# Altium project GanInverter.PrjPCB (part 1 of 3)
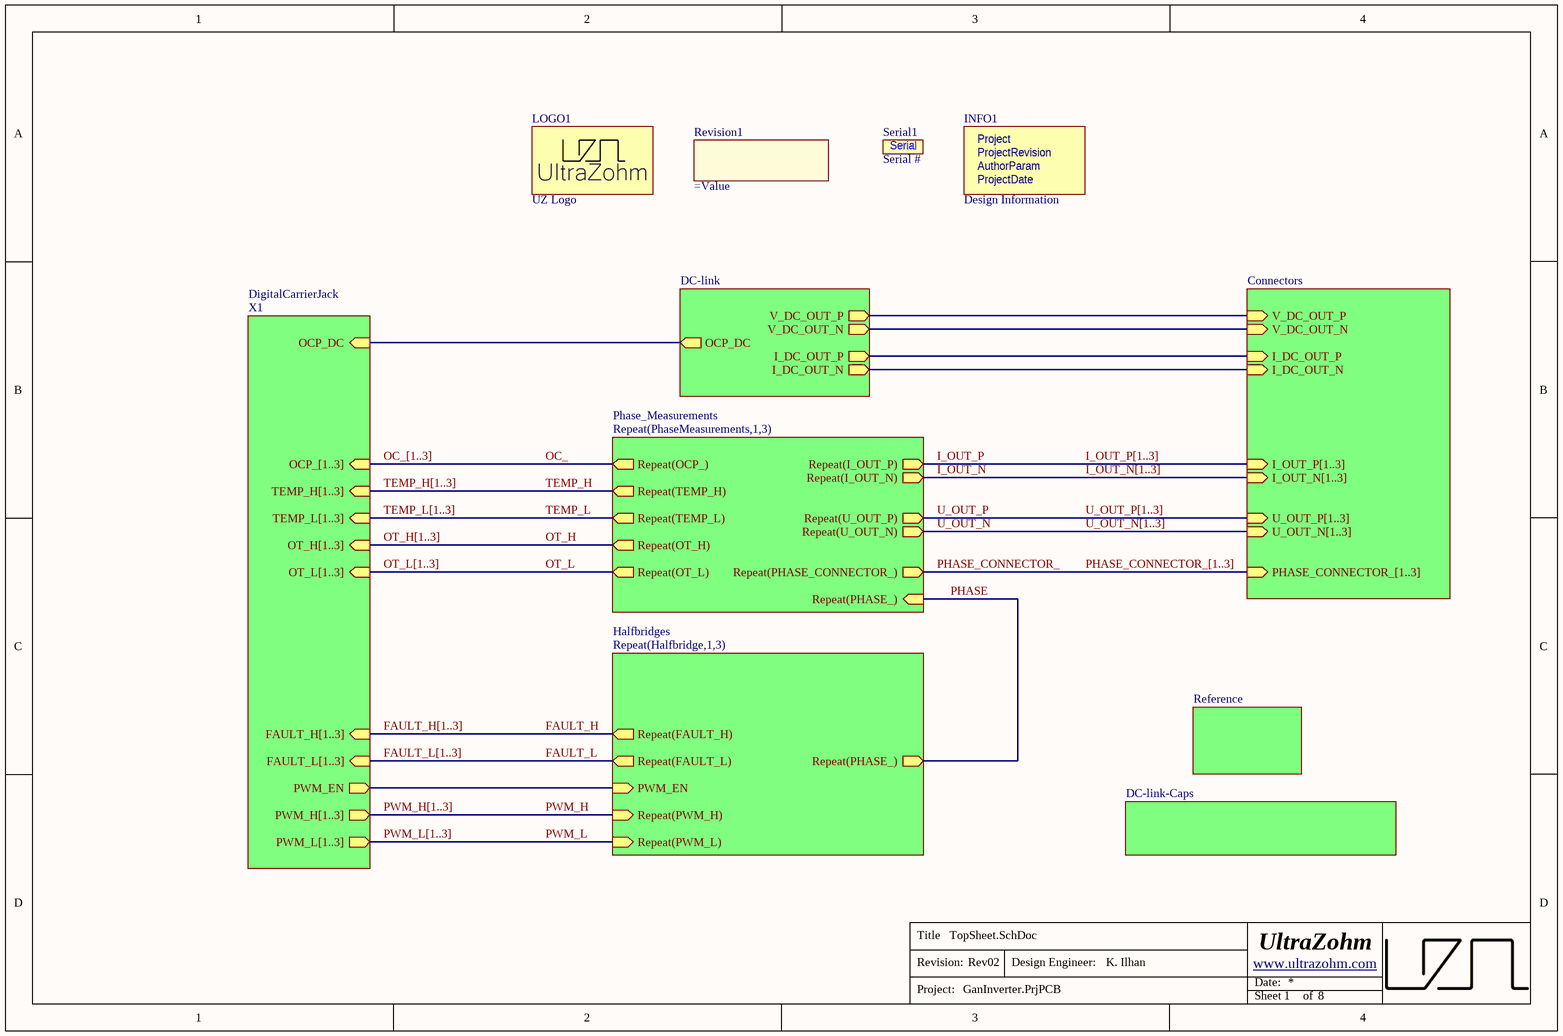
[diagram p0: TopSheet.SchDoc]
Author: K. Ilhan; AuthorParam: K. Ilhan; Project: UZ_D_GaN_Inverter; ProjectDate: 07/23; ProjectRevision: Rev02
8 sheets, 564 parts. Net scope: hierarchical (ports join the sheet entries above them; power ports are global).
Board file: GanInverter.PcbDoc
Sheets:
  TopSheet.SchDoc
    X1 = DigitalCarrierJack.SchDoc
     = Connectors.SchDoc
     = Reference.SchDoc
    PhaseMeasurements1 = Phase_Measurements.SchDoc
    PhaseMeasurements2 = Phase_Measurements.SchDoc
    PhaseMeasurements3 = Phase_Measurements.SchDoc
    Halfbridge1 = Halfbridges.SchDoc
    Halfbridge2 = Halfbridges.SchDoc
    Halfbridge3 = Halfbridges.SchDoc
     = DC-link.SchDoc
    DC-link-Caps = DC-link-Caps.SchDoc

## Sheet TopSheet.SchDoc
size A4; Author: K. Ilhan; CompanyName: Technische Hochschule Nürnberg Georg Simon Ohm; Organization: UltraZohm; Address1: Kesslerplatz 12; Address2: 90489 Nürnberg; Address3: GERMANY; SheetNumber: 1; SheetTotal: 8; Website: www.ultrazohm.com

### Parts
INFO1  Design Information  [Design_info]  (no BOM)
LOGO1  UZ Logo  [UZ_Logo_small]  (no BOM)
Revision1  (no value)  [Designator:comment]  (no BOM)
Serial1  Serial #  [SERIAL]  (no BOM)

### Sub-sheets
DC-link-Caps = DC-link-Caps.SchDoc: no entries
Repeat(Halfbridge,1,3) = Halfbridges: Repeat(PWM_H) (in), Repeat(PWM_L) (in), Repeat(PHASE_) (out), PWM_EN (in), Repeat(FAULT_L) (out), Repeat(FAULT_H) (out)
Repeat(PhaseMeasurements,1,3) = Phase_Measurements: Repeat(I_OUT_P) (out), Repeat(I_OUT_N) (out), Repeat(U_OUT_P) (out), Repeat(U_OUT_N) (out), Repeat(OT_H) (out), Repeat(OT_L) (out), Repeat(TEMP_H) (out), Repeat(TEMP_L) (out), Repeat(PHASE_CONNECTOR_) (out), Repeat(PHASE_) (in), Repeat(OCP_) (out)
X1 = DigitalCarrierJack: PWM_H[1..3] (out), PWM_L[1..3] (out), OT_H[1..3] (in), OT_L[1..3] (in), TEMP_H[1..3] (in), TEMP_L[1..3] (in), FAULT_L[1..3] (in), FAULT_H[1..3] (in), OCP_[1..3] (in), OCP_DC (in), PWM_EN (out)
? = Connectors: I_DC_OUT_N (in), I_DC_OUT_P (in), I_OUT_P[1..3] (in), I_OUT_N[1..3] (in), U_OUT_P[1..3] (in), U_OUT_N[1..3] (in), V_DC_OUT_N (in), V_DC_OUT_P (in), PHASE_CONNECTOR_[1..3] (in)
? = Reference: no entries
? = DC-link: I_DC_OUT_N (out), I_DC_OUT_P (out), V_DC_OUT_N (out), V_DC_OUT_P (out), OCP_DC (out)

### Nets
FAULT_H: sheet Repeat(Halfbridge,1,3)/Repeat(FAULT_H)
FAULT_L: sheet Repeat(Halfbridge,1,3)/Repeat(FAULT_L)
I_DC_OUT_N: sheet /I_DC_OUT_N, sheet /I_DC_OUT_N
I_DC_OUT_P: sheet /I_DC_OUT_P, sheet /I_DC_OUT_P
I_OUT_N: sheet Repeat(PhaseMeasurements,1,3)/Repeat(I_OUT_N)
I_OUT_P: sheet Repeat(PhaseMeasurements,1,3)/Repeat(I_OUT_P)
OC_: sheet Repeat(PhaseMeasurements,1,3)/Repeat(OCP_)
OCP_DC: sheet X1/OCP_DC, sheet /OCP_DC
OT_H: sheet Repeat(PhaseMeasurements,1,3)/Repeat(OT_H)
OT_L: sheet Repeat(PhaseMeasurements,1,3)/Repeat(OT_L)
PHASE: sheet Repeat(PhaseMeasurements,1,3)/Repeat(PHASE_), sheet Repeat(Halfbridge,1,3)/Repeat(PHASE_)
PHASE_CONNECTOR_: sheet Repeat(PhaseMeasurements,1,3)/Repeat(PHASE_CONNECTOR_)
PWM_EN: sheet X1/PWM_EN, sheet Repeat(Halfbridge,1,3)/PWM_EN
PWM_H: sheet Repeat(Halfbridge,1,3)/Repeat(PWM_H)
PWM_L: sheet Repeat(Halfbridge,1,3)/Repeat(PWM_L)
TEMP_H: sheet Repeat(PhaseMeasurements,1,3)/Repeat(TEMP_H)
TEMP_L: sheet Repeat(PhaseMeasurements,1,3)/Repeat(TEMP_L)
U_OUT_N: sheet Repeat(PhaseMeasurements,1,3)/Repeat(U_OUT_N)
U_OUT_P: sheet Repeat(PhaseMeasurements,1,3)/Repeat(U_OUT_P)
V_DC_OUT_N: sheet /V_DC_OUT_N, sheet /V_DC_OUT_N
V_DC_OUT_P: sheet /V_DC_OUT_P, sheet /V_DC_OUT_P

### Buses and harness runs
bus FAULT_H[1..3] = sheet X1/FAULT_H[1..3]
bus FAULT_L[1..3] = sheet X1/FAULT_L[1..3]
bus I_OUT_N[1..3] = sheet /I_OUT_N[1..3]
bus I_OUT_P[1..3] = sheet /I_OUT_P[1..3]
bus OC_[1..3] = sheet X1/OCP_[1..3]
bus OT_H[1..3] = sheet X1/OT_H[1..3]
bus OT_L[1..3] = sheet X1/OT_L[1..3]
bus PHASE_CONNECTOR_[1..3] = sheet /PHASE_CONNECTOR_[1..3]
bus PWM_H[1..3] = sheet X1/PWM_H[1..3]
bus PWM_L[1..3] = sheet X1/PWM_L[1..3]
bus TEMP_H[1..3] =  = sheet X1/TEMP_H[1..3]
bus TEMP_L[1..3] =  = sheet X1/TEMP_L[1..3]
bus U_OUT_N[1..3] = sheet /U_OUT_N[1..3]
bus U_OUT_P[1..3] = sheet /U_OUT_P[1..3]

### Notes on the sheet
- Title
- Revision:
- Design Engineer:
- Date:
- Project:
- Sheet
- of
- (in symbol Design Information) Project; ProjectRevision; AuthorParam; ProjectDate
- (in symbol SerialNumber) Serial

### Library data of the parts
INFO1 = Design Information: Manufacturer: UltraZohm; Created from: MGremer; Manufacturer Part Number: Design Information; PartID: 12; Created On: 11/3/2021 9:04:23 AM; ComponentLink1Description: https://docs.ultrazohm.com/; ComponentLink1URL: homepage; Component Type: Design Information; Last Updated: 11/3/2021 9:28:34 AM; Supplier 1: -; Supplier Part Number 1: -; Type: Design Information; Value: Design Information; Live Cycle Status: 1
LOGO1 = Logo small: Manufacturer: UltraZohm; Created from: MGremer; Created: Jan2021_Liegmann; Value: Logo; Manufacturer Part Number: Logo small; PartID: 10; Created On: 11/3/2021 9:04:23 AM; ComponentLink1Description: https://docs.ultrazohm.com/; ComponentLink1URL: homepage; Component Type: Logo; Last Updated: 11/3/2021 9:05:50 AM; Supplier 1: -; Supplier Part Number 1: -; Type: Logo; Live Cycle Status: 1
Revision1 = ProjectRevision: Value: Rev02; Created: 2020-01-08_Thilo_Wendt
Serial1 = SerialNumber: Empty serial number of the PCB. Can be used for manually writing the serial number

## Sheet DigitalCarrierJack.SchDoc
size A4; Author: K. Ilhan; CompanyName: Technische Hochschule Nürnberg Georg Simon Ohm; Organization: UltraZohm; Address1: Kesslerplatz 12; Address2: 90489 Nürnberg; Address3: GERMANY; SheetNumber: 2; SheetTotal: 8; Website: www.ultrazohm.com
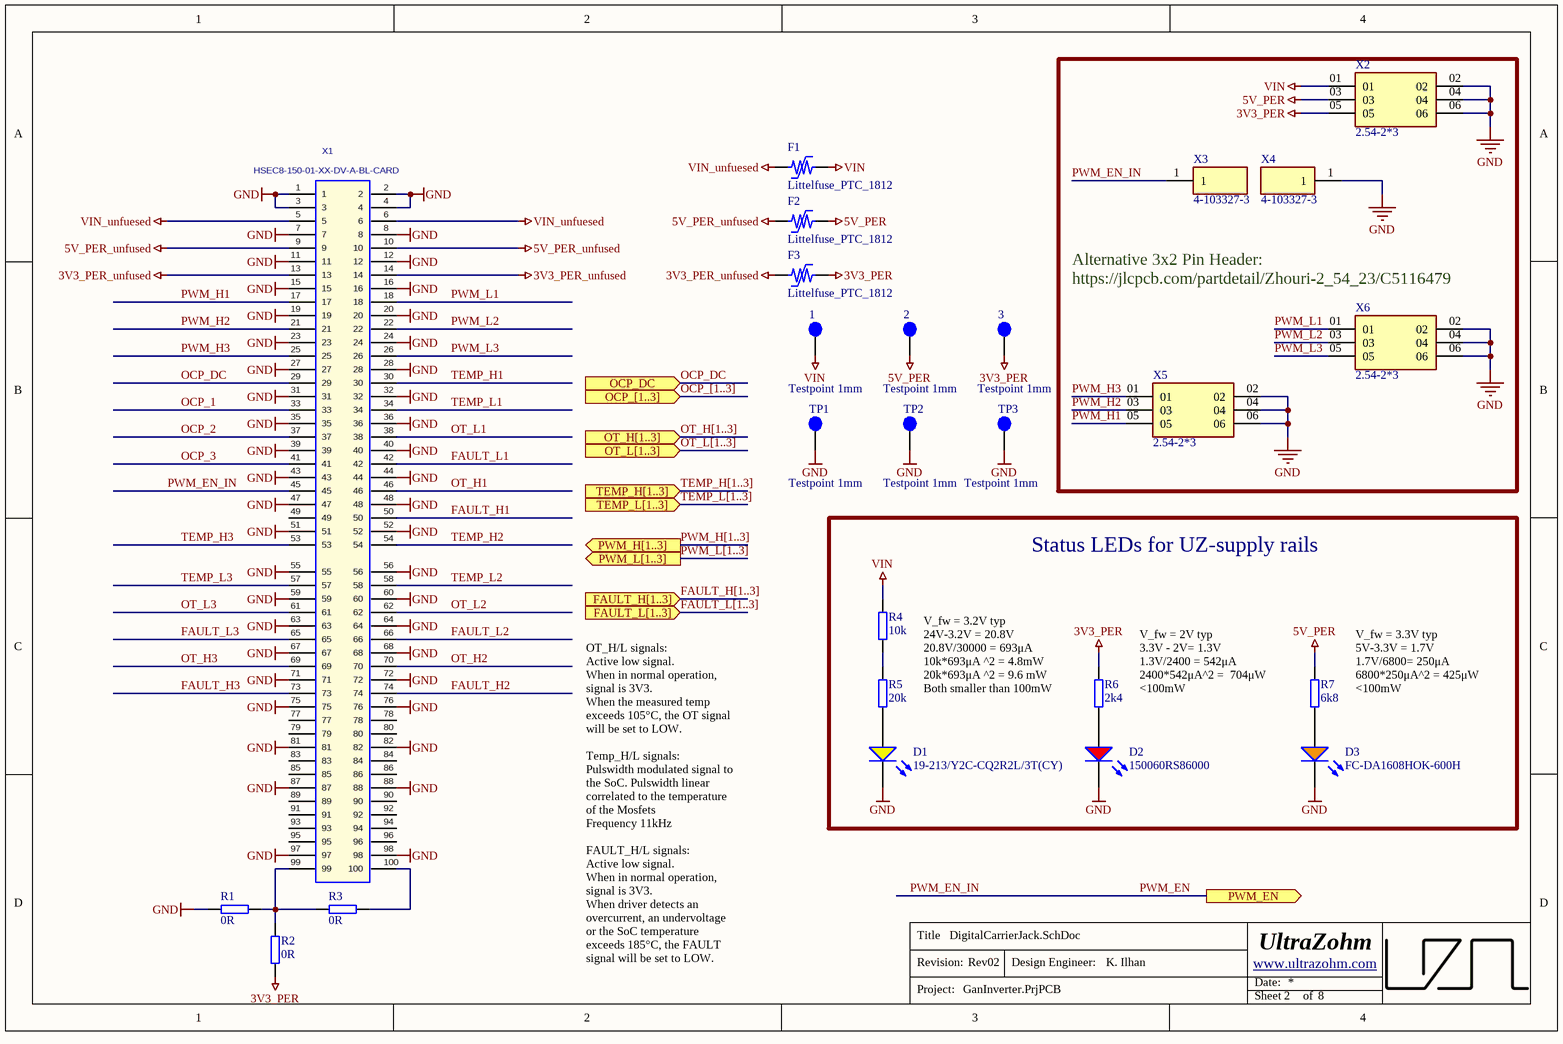
[diagram p1: DigitalCarrierJack.SchDoc]

### Parts
1  Testpoint 1mm  [TP_1mm]  (no BOM)
2  Testpoint 1mm  [TP_1mm]  (no BOM)
3  Testpoint 1mm  [TP_1mm]  (no BOM)
D1  19-213/Y2C-CQ2R2L/3T(CY)  [WL-SMCW_0603]
D2  150060RS86000  [WL-SMCW_0603]
D3  FC-DA1608HOK-600H  [WL-SMCW_0603]
F1  Littelfuse_PTC_1812  [1812_PTC_Polyfuse_Littelfuse]
F2  Littelfuse_PTC_1812  [1812_PTC_Polyfuse_Littelfuse]
F3  Littelfuse_PTC_1812  [1812_PTC_Polyfuse_Littelfuse]
R1  0R  [RES 0603_1608]
R2  0R  [RES 0603_1608]
R3  0R  [RES 0603_1608]
R4  10k  [RES 0603_1608]
R5  20k  [RES 0603_1608]
R6  2k4  [RES 0603_1608]
R7  6k8  [RES 0603_1608]
TP1  Testpoint 1mm  [TP_1mm]  (no BOM)
TP2  Testpoint 1mm  [TP_1mm]  (no BOM)
TP3  Testpoint 1mm  [TP_1mm]  (no BOM)
X1  HSEC8-150-01-XX-DV-A-BL-CARD  [HSEC8-150-01-XX-DV-A-BL-CARD]  (no BOM)
X2  2.54-2*3  [SAMTEC_TSW-103-05-G-D]
X3  4-103327-3  [1_Pin_Header]
X4  4-103327-3  [1_Pin_Header]
X5  2.54-2*3  [SAMTEC_TSW-103-05-G-D]
X6  2.54-2*3  [SAMTEC_TSW-103-05-G-D]

### Blocks framed on the sheet
Status LEDs for UZ-supply rails: D1-D3 R4-R7

### Ports
FAULT_H[1..3] (in), FAULT_L[1..3] (in), OCP_[1..3] (in), OCP_DC (in), OT_H[1..3] (in), OT_L[1..3] (in), PWM_EN (out), PWM_H[1..3] (out), PWM_L[1..3] (out), TEMP_H[1..3] (in), TEMP_L[1..3] (in)

### Nets
3V3_PER: 3.1 F3.2 R2.1 R6.2 X2.05
3V3_PER_unfused: F3.1 X1.13 X1.14
5V_PER: 2.1 F2.2 R7.2 X2.03
5V_PER_unfused: F2.1 X1.9 X1.10
GND: D1.1(K) D2.1(K) D3.1(K) R1.1 TP1.1 TP2.1 TP3.1 X1.1 X1.2 X1.3 X1.4 X1.7 X1.8 X1.11 X1.12 X1.15 X1.16 X1.19 X1.20 X1.23 X1.24 X1.27 X1.28 X1.31 X1.32 X1.35 X1.36 X1.39 X1.40 X1.43 X1.44 X1.47 X1.48 X1.51 X1.52 X1.55 X1.56 X1.59 X1.60 X1.63 X1.64 X1.67 X1.68 X1.71 X1.72 X1.75 X1.76 X1.81 X1.82 X1.87 X1.88 X1.97 X1.98 X2.02 X2.04 X2.06 X4.1 X5.02 X5.04 X5.06 X6.02 X6.04 X6.06
VIN: 1.1 F1.2 R4.2 X2.01
VIN_unfuesed: F1.1 X1.5 X1.6
FAULT_H1: X1.50  [project net FAULT_H]
FAULT_H2: X1.74  [project net FAULT_H]
FAULT_H3: X1.73  [project net FAULT_H]
FAULT_L1: X1.42  [project net FAULT_L]
FAULT_L2: X1.66  [project net FAULT_L]
FAULT_L3: X1.65  [project net FAULT_L]
OCP_1: X1.33  [project net OC_1]
OCP_2: X1.37  [project net OC_2]
OCP_3: X1.41  [project net OC_3]
OCP_DC: X1.29 ; port OCP_DC
OT_H1: X1.46
OT_H2: X1.70
OT_H3: X1.69
OT_L1: X1.38
OT_L2: X1.62
OT_L3: X1.61
PWM_EN: X1.45 X3.1 ; port PWM_EN  [also labelled PWM_EN_IN]
PWM_H1: X1.17 X5.05  [project net PWM_H]
PWM_H2: X1.21 X5.03  [project net PWM_H]
PWM_H3: X1.25 X5.01  [project net PWM_H]
PWM_L1: X1.18 X6.01  [project net PWM_L]
PWM_L2: X1.22 X6.03  [project net PWM_L]
PWM_L3: X1.26 X6.05  [project net PWM_L]
TEMP_H1: X1.30
TEMP_H2: X1.54
TEMP_H3: X1.53
TEMP_L1: X1.34
TEMP_L2: X1.58
TEMP_L3: X1.57
NetD1_2: D1.2(A) R5.1
NetD2_2: D2.2(A) R6.1
NetD3_2: D3.2(A) R7.1
NetR1_2: R1.2 R2.2 R3.1 X1.99
NetR3_2: R3.2 X1.100
NetR4_1: R4.1 R5.2

Not connected (* = marked no-connect by the designer): X1 49 77 78 79 80 83 84 85 86 89 90 91 92 93 94 95 96

### Buses and harness runs
bus FAULT_H[1..3] = port FAULT_H[1..3]
bus FAULT_L[1..3] = port FAULT_L[1..3]
bus OCP_[1..3] = port OCP_[1..3]
bus OT_H[1..3] = port OT_H[1..3]
bus OT_L[1..3] = port OT_L[1..3]
bus PWM_H[1..3] = port PWM_H[1..3]
bus PWM_L[1..3] = port PWM_L[1..3]
bus TEMP_H[1..3] = port TEMP_H[1..3]
bus TEMP_L[1..3] = port TEMP_L[1..3]

### Notes on the sheet
- (near X6) Alternative 3x2 Pin Header:
  https://jlcpcb.com/partdetail/Zhouri-2_54_23/C5116479
- V_fw = 3.2V typ
  24V-3.2V = 20.8V
  20.8V/30000 = 693μA
  10k*693μA ^2 = 4.8mW
  20k*693μA ^2 = 9.6 mW
  Both smaller than 100mW
- V_fw = 2V typ
  3.3V - 2V= 1.3V
  1.3V/2400 = 542μA
  2400*542μA^2 =  704μW
  <100mW
- V_fw = 3.3V typ
  5V-3.3V = 1.7V
  1.7V/6800= 250μA
  6800*250μA^2 = 425μW
  <100mW
- OT_H/L signals:
  Active low signal.
  When in normal operation, signal is 3V3.
  When the measured temp exceeds 105°C, the OT signal will be set to LOW.
- Temp_H/L signals:
  Pulswidth modulated signal to the SoC. Pulswidth linear correlated to the temperature of the Mosfets
  Frequency 11kHz
- FAULT_H/L signals:
  Active low signal.
  When in normal operation, signal is 3V3.
  When driver detects an overcurrent, an undervoltage or the SoC temperature exceeds 185°C, the FAULT signal will be set to LOW.
- Title
- Revision:
- Design Engineer:
- Date:
- Project:
- Sheet
- of

### Library data of the parts
1-3 TP1-TP3 = NULL: Manufacturer Part Number: NULL; Created from: AGeiger; Created: 2018_06_25_AGeiger; Value: Testpoint 1mm; PartID: 9; Created On: 9/20/2022 1:14:57 PM; Component Type: Testpoint; Last Updated: 9/20/2022 1:15:39 PM; Manufacturer: NULL; Supplier 1: NULL; Supplier Part Number 1: NULL; Type: Testpoint; Live Cycle Status: 1
D1 = 19-213/Y2C-CQ2R2L/3T(CY): LED YELLOW 585.5~591.5NM 90~180MCD@20MA TOP VIEW 0603 ROHS; Manufacturer: Everlight Elec; Type: Standard; Created from: T. Wendt; Forward Current I_f: 20 mA; Forward Voltage U_f: 2 V; Wavelength: 590 nm; Light Intensity: 180 mcd; Nominal Power: 40 mW; Manufacturer Part Number: 19-213/Y2C-CQ2R2L/3T(CY); PartID: 9; Created On: 3/3/2021 10:06:23 AM; ComponentLink1Description: Datasheet; ComponentLink1URL: https://datasheet.lcsc.com/szlcsc/Everlight-Elec-19-213-Y2C-CQ2R2L-3T-CY_C72038.pdf; Component Type: LED Diode; Device Package: 0603; Last Updated: 3/4/2021 9:02:49 AM; Mounting Type: SMD; Operating Temperature: -40 - 85 °C; Supplier 1: LCSC; Supplier Part Number 1: C72038; Live Cycle Status: 1; Stock number: not stored; Color: yellow; LCSC Part Number: C72038
D2 = 150060RS86000: WL-SMCW SMD Mono-color Chip LED Waterclear Red; Manufacturer: Wuerth Elektronik; Type: Standard; Created from: MGremer; Forward Current I_f: 20 mA; Forward Voltage U_f: 2 V; Wavelength: 624 nm; Light Intensity: 800 mcd; Nominal Power: 48 mW; Manufacturer Part Number: 150060RS86000; PartID: 3; Created On: 12/8/2020 10:48:12 AM; ComponentLink1Description: Datasheet; ComponentLink1URL: https://www.mouser.de/datasheet/2/445/150120RS75000-1714636.pdf; Component Type: LED Diode; Device Package: 0603; Last Updated: 2/15/2023 6:12:03 PM; Mounting Type: SMD; Operating Temperature: -40 - 85 °C; Supplier 1: Mouser; Supplier Part Number 1: 710-150060RS86000; Supplier 2: Farnell; Supplier Part Number 2: 3408608; Supplier 3: Digi-Key; Supplier Part Number 3: 732-150060RS86000CT-ND; Live Cycle Status: 1; Stock number: not stored; Color: red; LCSC Part Number: C389517
D3 = FC-DA1608HOK-600H: LED ORANGE 600~610NM 80~220MCD@20MA TOP VIEW 0603 ROHS; Manufacturer: Foshan NationStar Optoelectronics; Type: Standard; Created from: T. Wendt; Color: amber; Forward Current I_f: 20 mA; Forward Voltage U_f: 2 V; Wavelength: 604 nm; Light Intensity: 150 mcd; Nominal Power: 40 mW; Manufacturer Part Number: FC-DA1608HOK-600H; PartID: 10; Created On: 3/3/2021 9:59:51 AM; ComponentLink1Description: Datasheet; ComponentLink1URL: https://datasheet.lcsc.com/szlcsc/Foshan-NationStar-Optoelectronics-FC-DA1608HOK-600H_C84269.pdf; Component Type: LED Diode; Device Package: 0603; Last Updated: 3/4/2021 9:02:50 AM; Mounting Type: SMD; Operating Temperature: -40 - 85 °C; Supplier 1: LCSC; Supplier Part Number 1: C84269; Live Cycle Status: 1; Stock number: not stored; LCSC Part Number: C84269
F1-F3 = Littelfuse_PTC_1812: POLYSWITCH RESETTABLE DEVICES; MPN: miniASMDC110F/24; Value: PTC, 1.1 A, 24V; Voltage: 24V; Trip Current: 2.2A; Hold Current: 1.1A; Resistance: 0.18 Ohm; Type: Fuse; Nominal current: 1 A; Created from: MHlatky; MF: Littelfuse; Created: 2019_02_10_AGeiger; Package: 1812; ComponentLink1URL: https://www.littelfuse.com/~/media/electronics/datasheets/resettable_ptcs/littelfuse_ptc_surface_mount_catalog_datasheet.pdf.pdf; ComponentLink1Description: Datasheet; Manufacturer Part Number: Littelfuse_PTC_1812; PartID: 5; Created On: 5/7/2021 6:50:33 AM; Component Type: Littelfuse_PTC_1812; Last Updated: 5/27/2022 3:06:17 PM; Manufacturer: Littelfuse; Mounting Type: SMD; Operating Temperature: -40 - 85 °C; Supplier 1: Mouser; Supplier Part Number 1: 530-0ZCG0150BF2C; Live Cycle Status: 1; LCSC Part Number: C70119
R1-R3 = RC0603JR-070RL: SMD resistor E24 series; Manufacturer: YAGEO; Tolerance: 5%; Created from: MGremer; Manufacturer Part Number: RC0603JR-070RL; PartID: 1; Created On: 12/14/2020 4:17:14 PM; ComponentLink1Description: Datasheet; ComponentLink1URL: https://www.mouser.de/datasheet/2/447/PYu-RC_Group_51_RoHS_L_10-1664068.pdf; Component Type: SMD resistor; Device Package: 0603; Last Updated: 3/4/2021 9:09:42 AM; Mounting Type: SMD; Supplier 1: Mouser; Supplier Part Number 1: 603-RC0603JR-070RL; Supplier 2: LCSC; Supplier Part Number 2: C21189; Type: Resistor; Value: 0R; Live Cycle Status: 1; Stock number: Labor SMD Container; LCSC Part Number: C21189
R4 = RK73B1JTTD103J: SMD resistor E24 series; Manufacturer: KOA Speer; Tolerance: 5%; Created from: MGremer; Manufacturer Part Number: RK73B1JTTD103J; PartID: 98; Created On: 12/14/2020 4:17:14 PM; ComponentLink1Description: Datasheet; ComponentLink1URL: https://www.mouser.de/datasheet/2/219/RK73B-1825463.pdf; Component Type: SMD resistor; Device Package: 0603; Last Updated: 5/27/2022 2:04:22 PM; Mounting Type: SMD; Supplier 1: Mouser; Supplier Part Number 1: 660-RK73B1JTTD103J; Type: Resistor; Value: 10k; Live Cycle Status: 1; Stock number: Labor SMD Container; LCSC Part Number: C25804
R5 = 0603WAF2002T5E: SMD resistor E24 series; Manufacturer: UNI-ROYAL; Tolerance: 1%; Created from: AGeiger; Manufacturer Part Number: 0603WAF2002T5E; PartID: 105; Created On: 12/14/2020 4:17:14 PM; ComponentLink1Description: Datasheet; ComponentLink1URL: https://datasheet.lcsc.com/lcsc/2206010230_UNI-ROYAL-Uniroyal-Elec-0603WAF2002T5E_C4184.pdf; Component Type: SMD resistor; Device Package: 0603; Last Updated: 8/25/2022 8:05:50 PM; Mounting Type: SMD; Supplier 1: LCSC; Supplier Part Number 1: C4184; Type: Resistor; Value: 20k; Live Cycle Status: 1; Stock number: Labor SMD Container; LCSC Part Number: C4184
R6 = CR0603F2K40P05Z: 100mW ±100ppm/℃ ±1% 2.4kΩ 0603 Chip Resistor - Surface Mount ROHS; Manufacturer: Ever Ohms Tech; Created from: KIlhan; Manufacturer Part Number: CR0603F2K40P05Z; PartID: 278; Created On: 7/5/2023 5:27:52 PM; ComponentLink1Description: Datasheet; ComponentLink1URL: https://jlcpcb.com/partdetail/Ever_OhmsTech-CR0603F2K40P05Z/C881363; Component Type: SMD resistor; Device Package: 0603; Last Updated: 7/5/2023 5:27:52 PM; Mounting Type: SMD; Supplier 1: LCSC; Supplier Part Number 1: C881363; Type: Resistor; Tolerance: 1%; Value: 2k4; Live Cycle Status: 1; Stock number: not stored; LCSC Part Number: C881363
R7 = RS-03K682JT: 100mW ±100ppm/℃ ±5% 6.8kΩ 0603  Chip Resistor - Surface Mount ROHS; Manufacturer: FH (Guangdong Fenghua Advanced Tech); Created from: KIlhan; Manufacturer Part Number: RS-03K682JT; PartID: 279; Created On: 7/5/2023 6:08:31 PM; ComponentLink1Description: Datasheet; ComponentLink1URL: https://jlcpcb.com/parts/2nd/Resistors/Chip_Resistor_Surface_Mount_4?searchTxt=6.8k; Component Type: SMD resistor; Device Package: 0603; Last Updated: 7/5/2023 6:19:43 PM; Supplier 1: LCSC; Supplier Part Number 1: C118365; Type: Resistor; Tolerance: 5%; Value: 6k8; Live Cycle Status: 1; Stock number: not stored; LCSC Part Number: C118365; Mounting Type: SMD
X1 = HSEC8-150-01-XX-DV-A-BL-CARD: Mating Card Layout for HSEC8-150-01-XX-DV-A-BL; Manufacturer: SAMTEC; Created: 2018_04_23_AGeiger; Value: HSEC8-150-01-XX-DV-A-BL-CARD
X2 X5 X6 = 2.54-2*3: Pin Header 3x2; Manufacturer: ZHOURI; MF: Samtec; Created from: KIlhan; Number of positions: 3; Availability: Unavailable; Value: *; Price: None; MP: TSW-103-05-G-D; Package: None; Manufacturer Part Number: 2.54-2*3; PartID: 14; Created On: 7/5/2023 4:24:09 PM; ComponentLink1Description: Datasheet; ComponentLink1URL: https://datasheet.lcsc.com/lcsc/2207291800_ZHOURI-2-54-1-3_C5116482.pdf; Component Type: Pin Header; Device Package: THT; Last Updated: 7/5/2023 4:24:09 PM; Mounting Type: THT; Operating Temperature: -55 -125 °C; Series: 2.54-1*3; Supplier 1: LCSC; Supplier Part Number 1: ZHOURI 2.54-1*3; Type: Pin Header; Live Cycle Status: 1; Stock number: not stored; Number of rows: 2; LCSC Part Number: C5116479
X3 X4 = 4-103327-3: Pin Header, 2.54mm, 1 Pin; Manufacturer: TE Connectivity; Created from: DHufnagel; Number of positions: 1; Manufacturer Part Number: 4-103327-3; PartID: 12; Created On: 8/18/2022 9:37:37 AM; ComponentLink1Description: Datasheet; ComponentLink1URL: https://www.mouser.de/datasheet/2/418/NG_CD_103327_T_baseFilename-749242.pdf; Component Type: Pin Header; Device Package: THT; Last Updated: 6/16/2023 12:29:10 PM; Mounting Type: THT; Operating Temperature: -65 - 105 °C; Series: AMPMODU MOD II; Supplier 1: Mouser; Supplier Part Number 1: 571-4-103327-3; Type: Pin Header; Live Cycle Status: 1; LCSC Part Number: C3347196; Stock number: not stored; Number of rows: 1

## Sheet Connectors.SchDoc
size A4; Author: K. Ilhan; CompanyName: Technische Hochschule Nürnberg Georg Simon Ohm; Organization: UltraZohm; Address1: Kesslerplatz 12; Address2: 90489 Nürnberg; Address3: GERMANY; SheetNumber: 3; SheetTotal: 8; Website: www.ultrazohm.com
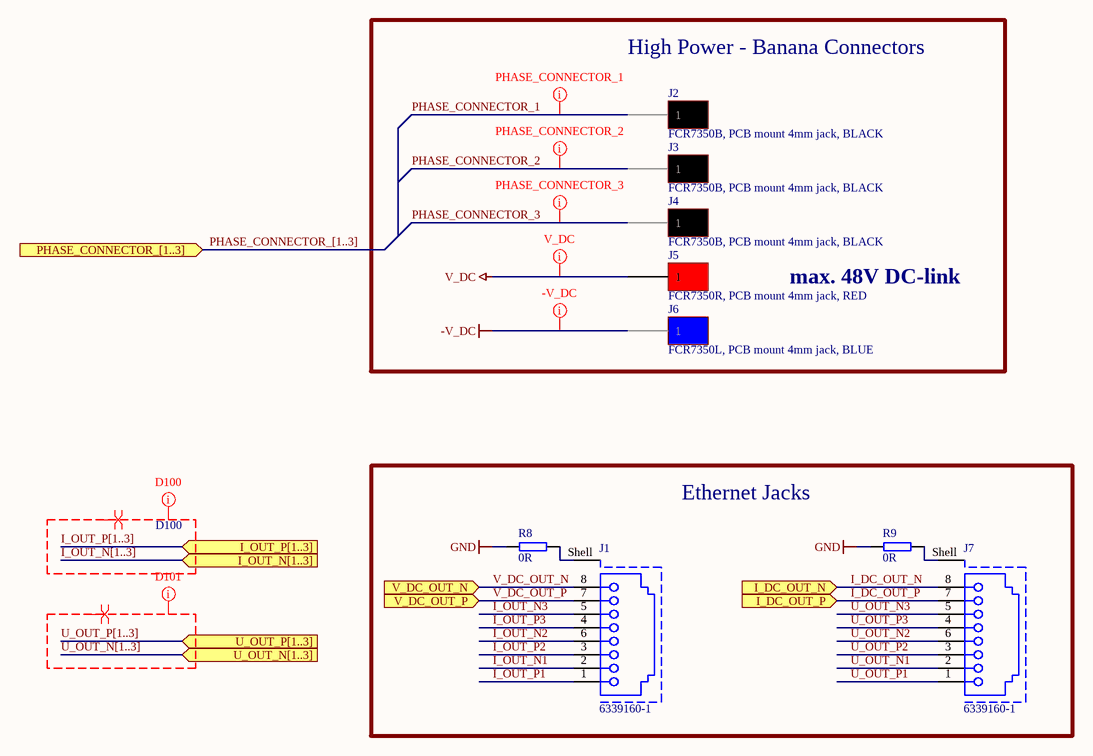
[diagram p2: Connectors.SchDoc]

### Parts
J1  6339160-1  [634008149821]
J2  FCR7350B, PCB mount 4mm jack, BLACK  [FCR7350]
J3  FCR7350B, PCB mount 4mm jack, BLACK  [FCR7350]
J4  FCR7350B, PCB mount 4mm jack, BLACK  [FCR7350]
J5  FCR7350R, PCB mount 4mm jack, RED  [FCR7350]
J6  FCR7350L, PCB mount 4mm jack, BLUE  [FCR7350]
J7  6339160-1  [634008149821]
R8  0R  [RES 0603_1608]
R9  0R  [RES 0603_1608]

### Blocks framed on the sheet
Ethernet Jacks: J1 J7 R8 R9

### Ports
I_DC_OUT_N (in), I_DC_OUT_P (in), I_OUT_N[1..3] (in), I_OUT_P[1..3] (in), PHASE_CONNECTOR_[1..3] (in), U_OUT_N[1..3] (in), U_OUT_P[1..3] (in), V_DC_OUT_N (in), V_DC_OUT_P (in)

### Nets
-V_DC: J6.1
GND: R8.1 R9.1
V_DC: J5.1
I_DC_OUT_N: J7.8 ; port I_DC_OUT_N
I_DC_OUT_P: J7.7 ; port I_DC_OUT_P
I_OUT_N1: J1.2  [project net I_OUT_N]
I_OUT_N2: J1.6  [project net I_OUT_N]
I_OUT_N3: J1.5  [project net I_OUT_N]
I_OUT_P1: J1.1  [project net I_OUT_P]
I_OUT_P2: J1.3  [project net I_OUT_P]
I_OUT_P3: J1.4  [project net I_OUT_P]
PHASE_CONNECTOR_1: J2.1  [project net PHASE_CONNECTOR_]
PHASE_CONNECTOR_2: J3.1  [project net PHASE_CONNECTOR_]
PHASE_CONNECTOR_3: J4.1  [project net PHASE_CONNECTOR_]
U_OUT_N1: J7.2  [project net U_OUT_N]
U_OUT_N2: J7.6  [project net U_OUT_N]
U_OUT_N3: J7.5  [project net U_OUT_N]
U_OUT_P1: J7.1  [project net U_OUT_P]
U_OUT_P2: J7.3  [project net U_OUT_P]
U_OUT_P3: J7.4  [project net U_OUT_P]
V_DC_OUT_N: J1.8 ; port V_DC_OUT_N
V_DC_OUT_P: J1.7 ; port V_DC_OUT_P
NetJ1_Shell: J1.Shell R8.2
NetJ7_Shell: J7.Shell R9.2

### Buses and harness runs
bus I_OUT_N[1..3] = port I_OUT_N[1..3]
bus I_OUT_P[1..3] = port I_OUT_P[1..3]
bus PHASE_CONNECTOR_[1..3] = port PHASE_CONNECTOR_[1..3]
bus U_OUT_N[1..3] = port U_OUT_N[1..3]
bus U_OUT_P[1..3] = port U_OUT_P[1..3]

### Layout directives
differential pair: I_OUT_N[1..3], I_OUT_P[1..3], U_OUT_N[1..3], U_OUT_P[1..3]
net class D100: I_OUT_N[1..3], I_OUT_P[1..3]
mark named D101: U_OUT_N[1..3], U_OUT_P[1..3]
net class Power: -V_DC, PHASE_CONNECTOR_, V_DC

### Notes on the sheet
- High Power - Banana Connectors
- max. 48V DC-link
- Title
- Revision:
- Design Engineer:
- Date:
- Project:
- Sheet
- of

### Library data of the parts
J1 J7 = 6339160-1: RJ45 RJReceptacle 1 Yes cat5 Without LED SMD Ethernet Connectors/Modular Connectors (RJ45 RJ11) ROHS; Manufacturer: TE; Match Code: WR-MJ; Contact Resistance: 20mOhm; Insulation Resistance: 500MOhm; LED: No; Number of Ports: 1; Rated Current: 1.5A; Working Voltage: 120VAC; Withstanding Voltage: 1000VAC; Created from: NDiringer; ComponentLink1Description: Datasheet; ComponentLink1URL: https://jlcpcb.com/partdetail/TeConnectivity-63391601/C125076; ComponentLink2Description: Datasheet; ComponentLink2URL: https://www.we-online.com/redexpert/spec/634008149821?ad; Category: Input/Output Connectors; Manufacturer Part Number: 6339160-1; Mount: Surface Mount; Operating Temperature Max: 85°C; Operating Temperature Min: -40°C; Packaging: Tray; Number of Pins: 8P8C; Orientation: Horizontal; Shielding: Yes; PartID: 8; Created On: 4/20/2023 12:29:11 PM; Component Type: RJ45 Connector; Device Package: RJ45; Last Updated: 4/20/2023 12:29:11 PM; Mounting Type: SMD; Series: RJHSE; Supplier 1: LCSC; Supplier Part Number 1: C125076; Type: RJ45 Connector; Live Cycle Status: 1; Stock number: not stored; LCSC Part Number: C125076
J2-J4 = FCR7350B: FCR7350B, 1000V, 24A, BLACK; Manufacturer: Cliff; Value: PCB mount 4mm jack, Black	FCR7350B, 1000V, 24A; Created from: DHufnagel; Manufacturer Part Number: FCR7350B; PartID: 6; Created On: 6/13/2022 10:18:11 AM; ComponentLink1Description: datasheet; ComponentLink1URL: https://www.cliffuk.co.uk/products/testleads/sockets/S16NPC.pdf; ComponentLink2Description: drawing; ComponentLink2URL: https://media.digikey.com/pdf/Data%20Sheets/Cliff%20Electronic%20LTD%20PDF's/FCR7350_Drawing.pdf; Component Type: PCB mount 4mm jack, Black; Device Package: THT; Last Updated: 6/28/2022 1:58:37 PM; Minimum Order: 1; Mounting Type: THT; Operating Temperature: -40°C - 80°C; Series: S16N-PC; Supplier 1: Digi-Key; Supplier Part Number 1: 3185-FCR7350B-ND; Supplier 2: farnell; Supplier Part Number 2: 1854507; Type: PCB mount 4mm jack, Black	FCR7350B, 1000V, 24A; Live Cycle Status: 1; Stock number: not stored
J5 = FCR7350R: FCR7350B, 1000V, 24A, RED; Manufacturer: Cliff; Value: PCB mount 4mm jack, Red FCR7350R, 1000V, 24A; Created from: DHufnagel; Manufacturer Part Number: FCR7350R; PartID: 7; Created On: 6/13/2022 10:18:11 AM; ComponentLink1Description: datasheet; ComponentLink1URL: https://www.cliffuk.co.uk/products/testleads/sockets/S16NPC.pdf; ComponentLink2Description: drawing; ComponentLink2URL: https://media.digikey.com/pdf/Data%20Sheets/Cliff%20Electronic%20LTD%20PDF's/FCR7350_Drawing.pdf; Component Type: PCB mount 4mm jack, Red; Device Package: THT; Last Updated: 6/28/2022 1:58:37 PM; Minimum Order: 1; Mounting Type: THT; Operating Temperature: -40°C - 80°C; Series: S16N-PC; Supplier 1: Digi-Key; Supplier Part Number 1: 3185-FCR7350R-ND; Supplier 2: farnell; Supplier Part Number 2: 1854508; Type: PCB mount 4mm jack, Red FCR7350R, 1000V, 24A; Live Cycle Status: 1; Stock number: not stored
J6 = FCR7350L: FCR7350B, 1000V, 24A, BLUE; Manufacturer: Cliff; Value: PCB mount 4mm jack, Blue FCR7350L, 1000V, 24A; Created from: DHufnagel; Manufacturer Part Number: FCR7350L; PartID: 8; Created On: 6/13/2022 10:18:11 AM; ComponentLink1Description: datasheet; ComponentLink1URL: https://www.cliffuk.co.uk/products/testleads/sockets/S16NPC.pdf; ComponentLink2Description: drawing; ComponentLink2URL: https://media.digikey.com/pdf/Data%20Sheets/Cliff%20Electronic%20LTD%20PDF's/FCR7350_Drawing.pdf; Component Type: PCB mount 4mm jack, Blue; Device Package: THT; Last Updated: 6/28/2022 1:58:37 PM; Minimum Order: 1; Mounting Type: THT; Operating Temperature: -40°C - 80°C; Series: S16N-PC; Supplier 1: Digi-Key; Supplier Part Number 1: 3185-FCR7350L-ND; Supplier 2: farnell; Supplier Part Number 2: 1854511; Type: PCB mount 4mm jack, Blue FCR7350L, 1000V, 24A; Live Cycle Status: 1; Stock number: not stored
R8 R9 = RC0603JR-070RL: as R1 on sheet DigitalCarrierJack; Manufacturer Part Number: RC0603JR-070RL; PartID: 1; Created On: 12/14/2020 4:17:14 PM; ComponentLink1Description: Datasheet; ComponentLink1URL: https://www.mouser.de/datasheet/2/447/PYu-RC_Group_51_RoHS_L_10-1664068.pdf; Component Type: SMD resistor; Device Package: 0603; Last Updated: 3/4/2021 9:09:42 AM; Mounting Type: SMD; Supplier 1: Mouser; Supplier Part Number 1: 603-RC0603JR-070RL; Supplier 2: LCSC; Supplier Part Number 2: C21189; Type: Resistor; Value: 0R; Live Cycle Status: 1; Stock number: Labor SMD Container; LCSC Part Number: C21189

## Sheet Reference.SchDoc
size A4; Author: K. Ilhan; CompanyName: Technische Hochschule Nürnberg Georg Simon Ohm; Organization: UltraZohm; Address1: Kesslerplatz 12; Address2: 90489 Nürnberg; Address3: GERMANY; SheetNumber: 4; SheetTotal: 8; Website: www.ultrazohm.com
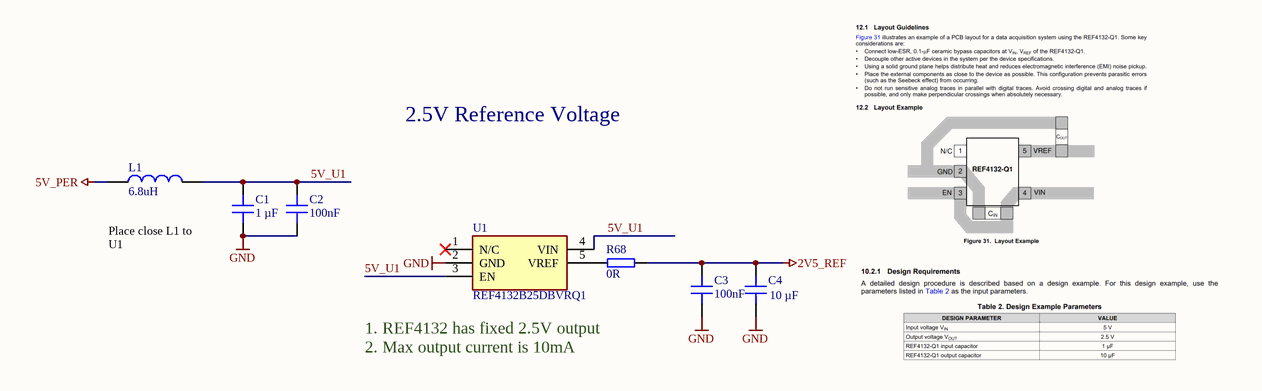
[diagram p3: Reference.SchDoc]

### Parts
C1  1 µF  [C_0603]
C2  100nF  [C_0603]
C3  100nF  [C_0603]
C4  10 µF  [C_0805]
L1  6.8uH  [INDC1608X95N]
R68  0R  [RES 0603_1608]
U1  REF4132B25DBVRQ1  [SOT95P280X145-5N]

### Nets
2V5_REF: C3.2 C4.2 R68.2
5V_PER: L1.1
GND: C1.1 C2.1 C3.1 C4.1 U1.2(GND)
5V_U1: C1.2 C2.2 L1.2 U1.3(EN) U1.4(VIN)
NetR68_1: R68.1 U1.5(VREF)

Not connected (* = marked no-connect by the designer): U1 1(N/C)*

### Notes on the sheet
- 2.5V Reference Voltage
- Place close L1 to U1
- 1. REF4132 has fixed 2.5V output
  2. Max output current is 10mA
- Title
- Revision:
- Design Engineer:
- Date:
- Project:
- Sheet
- of

### Library data of the parts
C1 = UMK107AB7105KA-T: 50V 1uF X7R ±10% 0603 Multilayer Ceramic Capacitors MLCC - SMD/SMT ROHS; Manufacturer: Taiyo Yuden; Voltage Rating: 50 VDC; Created from: NDiringer; Manufacturer Part Number: UMK107AB7105KA-T; PartID: 98; Created On: 8/9/2022 9:35:02 AM; ComponentLink1Description: Datasheet; ComponentLink1URL: https://www.mouser.de/datasheet/2/396/mlcc02_e-1307760.pdf; Component Type: Capacitor 0603; Device Package: 0603; Last Updated: 9/21/2022 4:11:37 PM; Mounting Type: SMD; Operating Temperature: -55 - 125°C; Series: X7R; Supplier 1: LCSC; Supplier Part Number 1: C105174; Type: Capacitor; Tolerance: 10 %; Value: 1 µF; Live Cycle Status: 1; Stock number: not stored; LCSC Part Number: C105174; Supplier 2: Mouser; Supplier Part Number 2: 963-UMK107AB7105MA-T
C2 C3 = CGA3E3X8R1H104KT0Y0N: 50V 100nF X8R ±10% 0603; Manufacturer: TDK; Voltage Rating: 50 VDC; Created from: KIlhan; Manufacturer Part Number: CGA3E3X8R1H104KT0Y0N; PartID: 131; Created On: 7/5/2023 7:32:58 PM; ComponentLink1Description: Datasheet; ComponentLink1URL: https://datasheet.lcsc.com/lcsc/2304140030_TDK-CGA3E3X8R1H104KT0Y0N_C342825.pdf; Component Type: Capacitor 0603; Device Package: 0603; Last Updated: 7/5/2023 7:32:58 PM; Mounting Type: SMD; Operating Temperature: -55 - 125°C; Series: CGA; Supplier 1: LCSC; Supplier Part Number 1: C342825; Type: Capacitor; Tolerance: 10 %; Value: 100nF; Live Cycle Status: 1; Stock number: not stored; LCSC Part Number: C342825
C4 = GRM219R61E106KA12D: Capacitor 0805, 25 VDC, 10 µF, X5R; Manufacturer: muRata; Tolerance: 10 %; Voltage Rating: 25 VDC; Created from: MGremer; Manufacturer Part Number: GRM219R61E106KA12D; PartID: 13; Created On: 12/20/2020 1:54:13 PM; ComponentLink1Description: Datasheet; ComponentLink1URL: https://www.mouser.de/datasheet/2/281/murata_03052018_GRM_Series_1-1310166.pdf; Component Type: Capacitor 0805; Device Package: 0805; Last Updated: 5/27/2022 2:14:39 PM; Mounting Type: SMD; Operating Temperature: -55 - 85°C; Series: GRM; Supplier 1: Mouser; Supplier Part Number 1: 81-GRM219R61E106KA2D; Type: Capacitor; Value: 10 µF; Live Cycle Status: 1; Stock number: Labor SMD Container; LCSC Part Number: C15850
L1 = CMCW1608F6R8KTT: 6.8uH ±10% 0603 Inductors (SMD) ROHS; Manufacturer: Cybermax; MF: EPCOS / TDK; DCR: 320m; Rated Current: 0.85 A; Type: fixed inductor; DC current: 15mA; Created from: KIlhan; MPN: B82464G4154M; Supplier 1: LCSC; Supplier Part Number 1: C961362; Value: 6.8uH; Manufacturer Part Number: CMCW1608F6R8KTT; PartID: 17; Created On: 7/5/2023 8:42:04 PM; ComponentLink1Description: Datasheet; ComponentLink1URL: https://jlcpcb.com/partdetail/Cybermax-CMCW1608F6R8KTT/C961362; Component Type: SMD fixed inductor; Device Package: SMD; Last Updated: 7/5/2023 8:42:04 PM; Mounting Type: SMD; Operating Temperature: -40 - 85 °C; Live Cycle Status: 1; LCSC Part Number: C961362; Stock number: C961362
R68 = RC0603JR-070RL: as R1 on sheet DigitalCarrierJack; Manufacturer Part Number: RC0603JR-070RL; PartID: 1; Created On: 12/14/2020 4:17:14 PM; ComponentLink1Description: Datasheet; ComponentLink1URL: https://www.mouser.de/datasheet/2/447/PYu-RC_Group_51_RoHS_L_10-1664068.pdf; Component Type: SMD resistor; Device Package: 0603; Last Updated: 3/4/2021 9:09:42 AM; Mounting Type: SMD; Supplier 1: Mouser; Supplier Part Number 1: 603-RC0603JR-070RL; Type: Resistor; Value: 0R; Live Cycle Status: 1; Stock number: Labor SMD Container; LCSC Part Number: C21189; Supplier 2: LCSC; Supplier Part Number 2: C21189
U1 = REF4132B25DBVRQ1: Voltage Reference, 2.5V, ±0.05%, ±10mA; Manufacturer: Texas Instruments; Created from: DHufnagel; Manufacturer Part Number: REF4132B25DBVRQ1; PartID: 10; Created On: 7/8/2022 12:48:56 PM; ComponentLink1Description: Datasheet; ComponentLink1URL: https://www.ti.com/general/docs/suppproductinfo.tsp?distId=26&gotoUrl=https://www.ti.com/lit/gpn/ref4132-q1; Component Type: Voltage Reference; Device Package: SMD; Last Updated: 6/15/2023 3:52:51 PM; Mounting Type: SMD; Operating Temperature: -40 - 125 °C; Series: -40 - 125 °C; Supplier 1: Mouser; Supplier Part Number 1: 595-REF4132B25DBVRQ1; Supplier 2: Digi-Key; Supplier Part Number 2: 296-REF4132B25DBVRQ1CT-ND; Type: Voltage Reference; Value: 2.5 V; Live Cycle Status: 1; LCSC Part Number: C2871658; Stock number: not stored